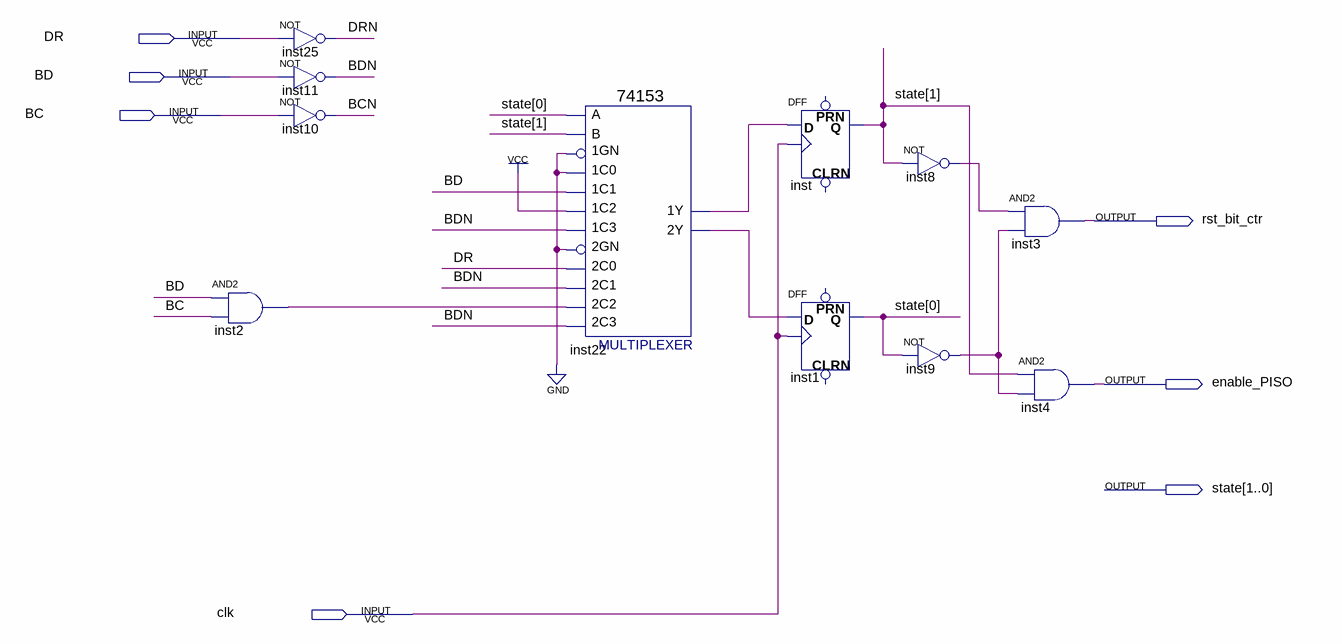
[diagram p0: schematic sheet]
// Quartus schematic tx_state_machine.bdf as structural Verilog: 11 symbols, 7 pins
module tx_state_machine (
  input  DR,
  input  BD,
  input  BC,
  input  clk,
  output rst_bit_ctr,
  output enable_PISO,
  output [1:0] state
);

  wire BCN, BDN, DRN, inst2_out, inst8_out, inst9_out, inst22_1y, inst22_2y;

  and inst2 (inst2_out, BD, BC);
  not inst25 (DRN, DR);
  not inst11 (BDN, BD);
  not inst10 (BCN, BC);
  \74153  inst22 (
    .\1C1 (BD), .\1GN (1'b0), .\1C0 (1'b0), .\2C0 (DR), .\2GN (1'b0), .\2C2 (inst2_out), .\1C2 (1'b1),
    .\1C3 (BDN), .B(state[1]), .A(state[0]), .\2C1 (BDN), .\2C3 (BDN), .\1Y (inst22_1y), .\2Y (inst22_2y));
  DFF inst (.CLK(clk), .D(inst22_1y), .Q(state[1]));  // open: CLRN, PRN
  DFF inst1 (.CLK(clk), .D(inst22_2y), .Q(state[0]));  // open: CLRN, PRN
  not inst8 (inst8_out, state[1]);
  not inst9 (inst9_out, state[0]);
  and inst3 (rst_bit_ctr, inst8_out, inst9_out);
  and inst4 (enable_PISO, state[1], inst9_out);
endmodule
